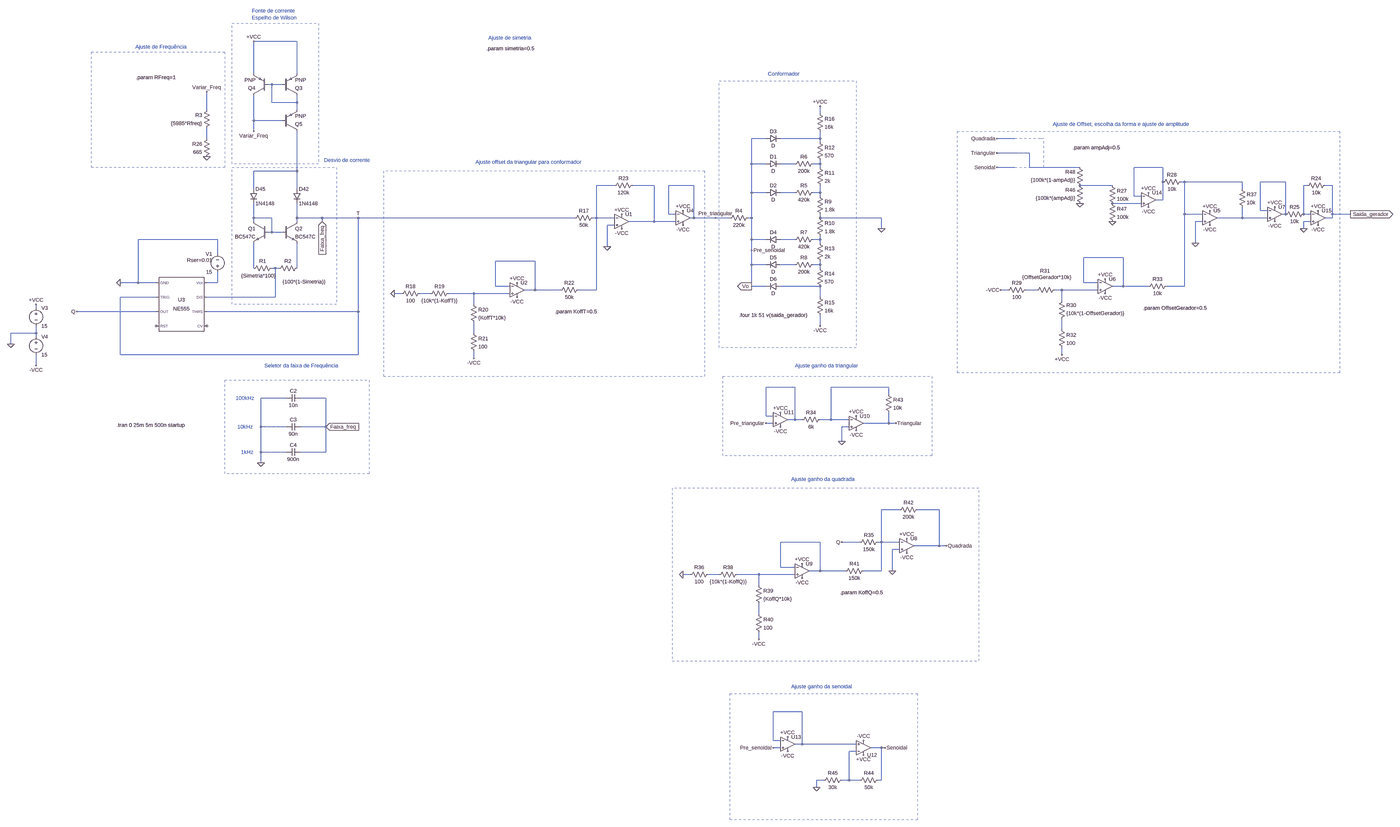
[diagram p0: schematic gerador_funcoes.asc, whole sheet]
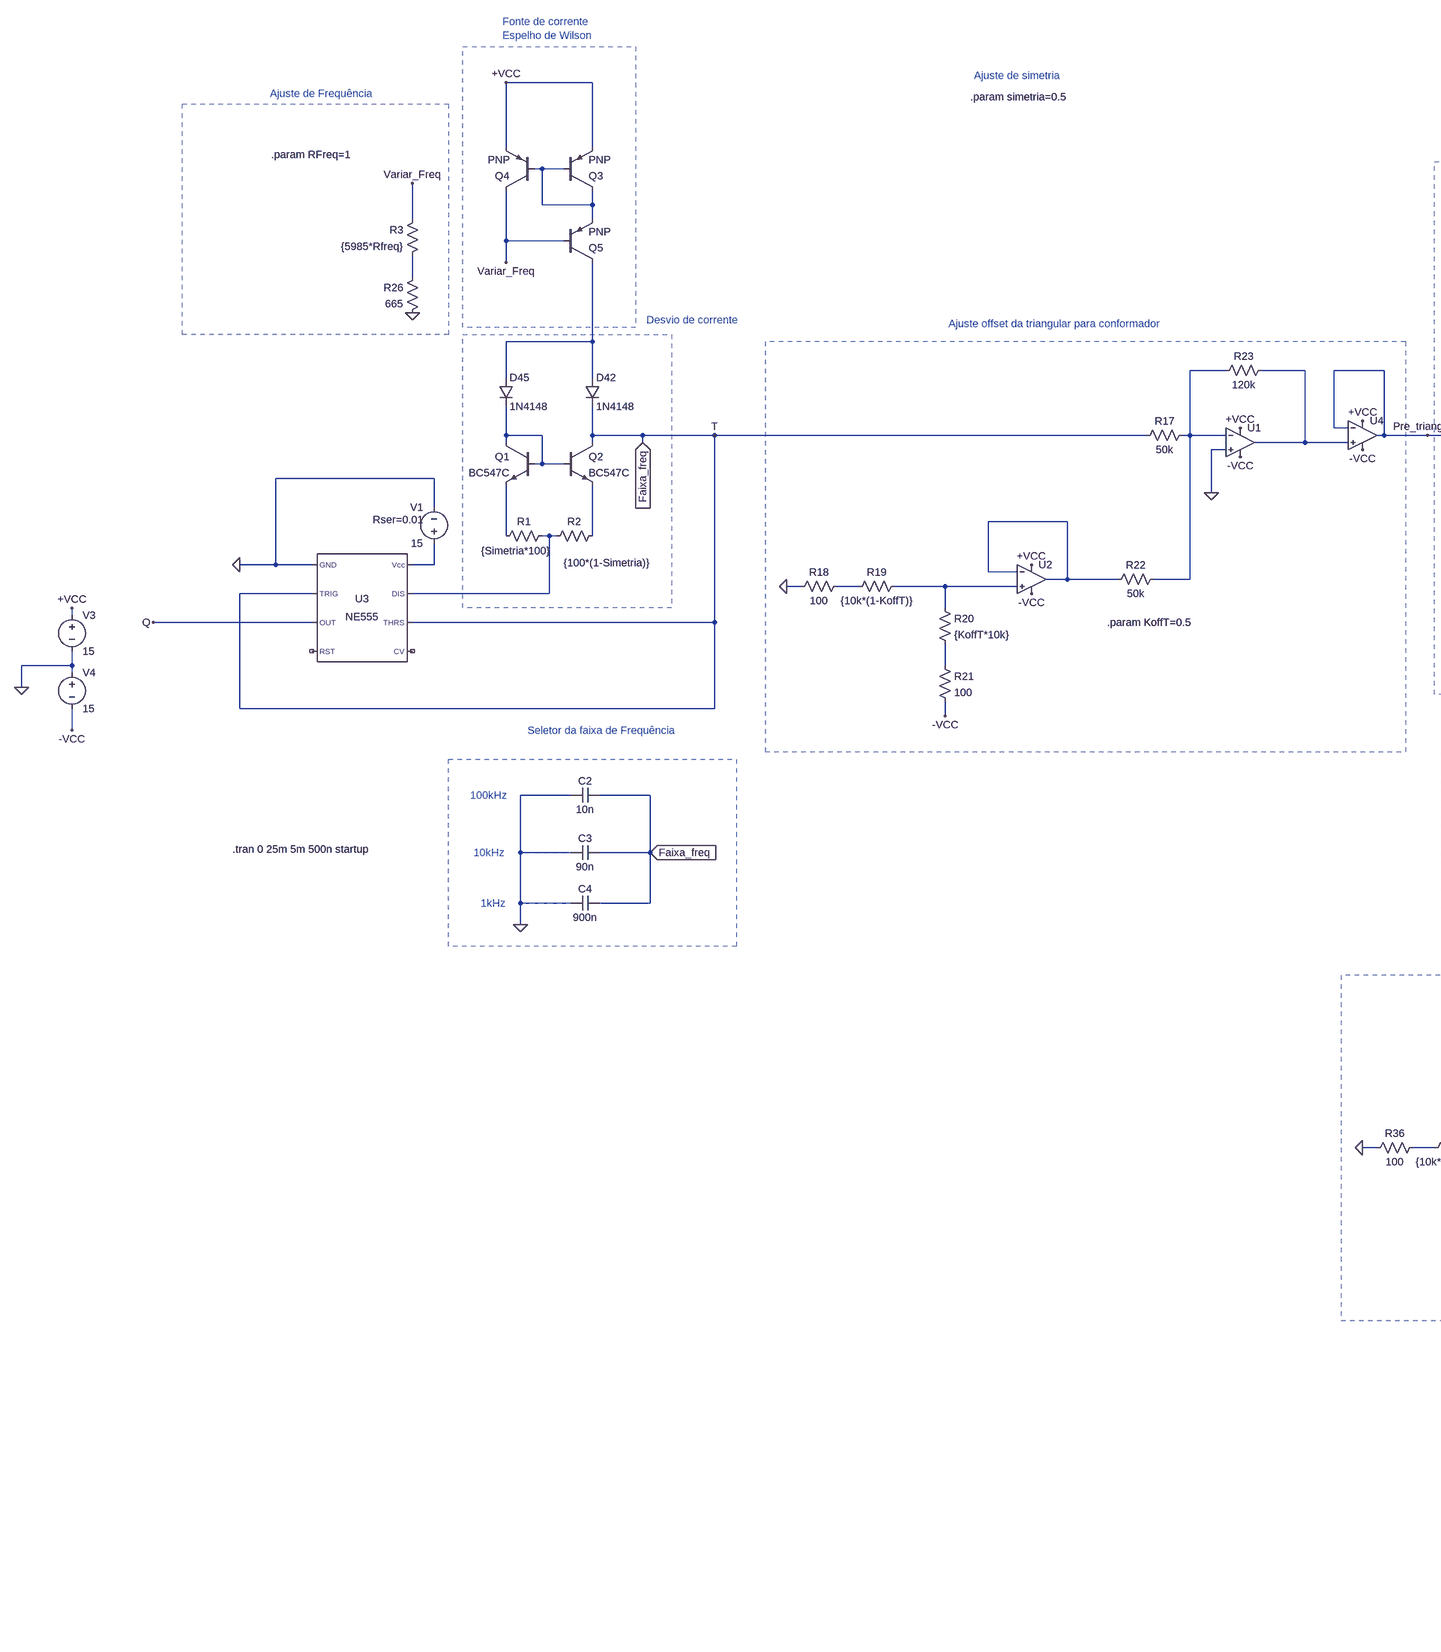
[diagram p1: schematic gerador_funcoes.asc, part, row 1 of 1, column 1 of 2]
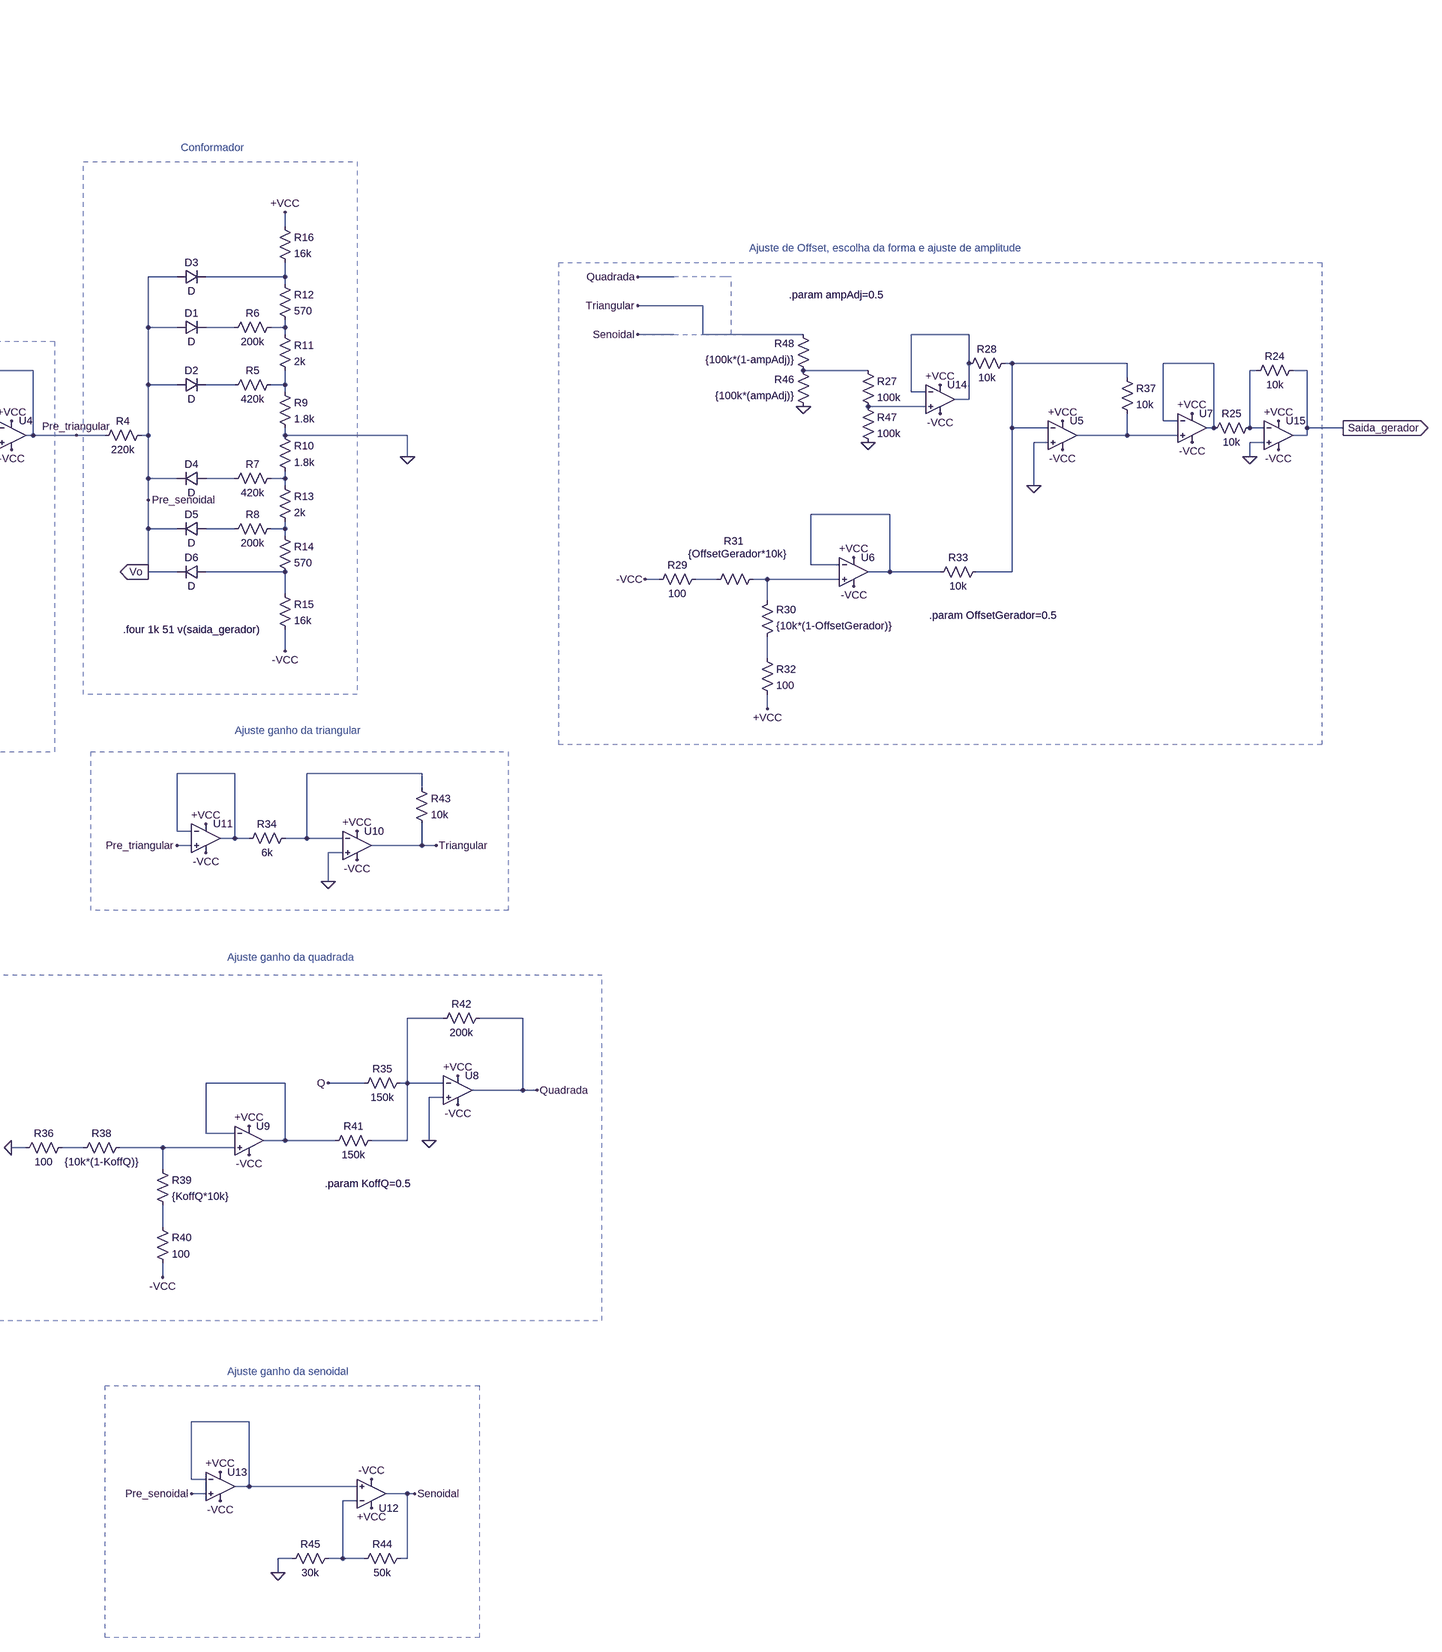
[diagram p2: schematic gerador_funcoes.asc, part, row 1 of 1, column 2 of 2]
gerador_funcoes.asc, the LTspice schematic file:
Version 4
SHEET 1 6488 2340
WIRE 1136 -1136 944 -1136
WIRE 944 -992 944 -1136
WIRE 1136 -992 1136 -1136
WIRE 1024 -944 1008 -944
WIRE 1072 -944 1024 -944
WIRE 1024 -864 1024 -944
WIRE 1136 -864 1136 -896
WIRE 1136 -864 1024 -864
WIRE 736 -832 736 -912
WIRE 1136 -832 1136 -864
WIRE 3456 -816 3456 -848
WIRE 944 -784 944 -896
WIRE 1072 -784 944 -784
WIRE 944 -736 944 -784
WIRE 736 -704 736 -752
WIRE 3216 -704 3152 -704
WIRE 3456 -704 3456 -736
WIRE 3456 -704 3280 -704
WIRE 4320 -704 4240 -704
WIRE 3456 -688 3456 -704
WIRE 4384 -640 4240 -640
WIRE 3152 -592 3152 -704
WIRE 3216 -592 3152 -592
WIRE 3344 -592 3280 -592
WIRE 3456 -592 3456 -608
WIRE 3456 -592 3424 -592
WIRE 3456 -576 3456 -592
WIRE 4320 -576 4240 -576
WIRE 4384 -576 4384 -640
WIRE 4608 -576 4384 -576
WIRE 4976 -576 4848 -576
WIRE 1136 -560 1136 -736
WIRE 1136 -560 944 -560
WIRE 4976 -512 4976 -576
WIRE 5072 -512 5056 -512
WIRE 5328 -512 5072 -512
WIRE 5520 -512 5408 -512
WIRE 2544 -496 2464 -496
WIRE 2720 -496 2624 -496
WIRE 2896 -496 2784 -496
WIRE 4752 -496 4608 -496
WIRE 5616 -496 5600 -496
WIRE 5728 -496 5696 -496
WIRE 944 -480 944 -560
WIRE 1136 -480 1136 -560
WIRE 5328 -480 5328 -512
WIRE 3152 -464 3152 -592
WIRE 3216 -464 3152 -464
WIRE 3344 -464 3280 -464
WIRE 3456 -464 3456 -496
WIRE 3456 -464 3424 -464
WIRE 3456 -448 3456 -464
WIRE 4848 -448 4848 -576
WIRE 4880 -448 4848 -448
WIRE 4976 -432 4976 -512
WIRE 4976 -432 4944 -432
WIRE 4880 -416 4752 -416
WIRE 5408 -384 5408 -512
WIRE 5440 -384 5408 -384
WIRE 2784 -368 2784 -496
WIRE 2816 -368 2784 -368
WIRE 5072 -368 5072 -512
WIRE 5152 -368 5072 -368
WIRE 5520 -368 5520 -512
WIRE 5520 -368 5504 -368
WIRE 5600 -368 5600 -496
WIRE 5632 -368 5600 -368
WIRE 5728 -368 5728 -496
WIRE 5808 -368 5728 -368
WIRE 944 -352 944 -416
WIRE 1024 -352 944 -352
WIRE 1136 -352 1136 -416
WIRE 1248 -352 1136 -352
WIRE 1408 -352 1248 -352
WIRE 2368 -352 1408 -352
WIRE 2464 -352 2464 -496
WIRE 2464 -352 2448 -352
WIRE 2544 -352 2464 -352
WIRE 2896 -352 2896 -496
WIRE 2896 -352 2880 -352
WIRE 2992 -352 2896 -352
WIRE 3056 -352 2992 -352
WIRE 3152 -352 3152 -464
WIRE 3152 -352 3136 -352
WIRE 3456 -352 3456 -368
WIRE 3728 -352 3456 -352
WIRE 5328 -352 5328 -400
WIRE 5328 -352 5216 -352
WIRE 5440 -352 5328 -352
WIRE 5728 -352 5728 -368
WIRE 5728 -352 5696 -352
WIRE 944 -336 944 -352
WIRE 1136 -336 1136 -352
WIRE 1248 -336 1248 -352
WIRE 2720 -336 2720 -496
WIRE 2720 -336 2608 -336
WIRE 2816 -336 2720 -336
WIRE 5152 -336 5120 -336
WIRE 5632 -336 5600 -336
WIRE 2544 -320 2512 -320
WIRE 3728 -304 3728 -352
WIRE 5600 -304 5600 -336
WIRE 1024 -288 1024 -352
WIRE 1024 -288 1008 -288
WIRE 1072 -288 1024 -288
WIRE 784 -256 432 -256
WIRE 3152 -256 3152 -352
WIRE 3216 -256 3152 -256
WIRE 3344 -256 3280 -256
WIRE 3456 -256 3456 -272
WIRE 3456 -256 3424 -256
WIRE 3456 -240 3456 -256
WIRE 5120 -240 5120 -336
WIRE 2512 -224 2512 -320
WIRE 3152 -208 3152 -256
WIRE 784 -192 784 -256
WIRE 4800 -176 4624 -176
WIRE 2192 -160 2016 -160
WIRE 3152 -144 3152 -208
WIRE 3216 -144 3152 -144
WIRE 3344 -144 3280 -144
WIRE 3456 -144 3456 -160
WIRE 3456 -144 3424 -144
WIRE 944 -128 944 -240
WIRE 1040 -128 1024 -128
WIRE 1056 -128 1040 -128
WIRE 1136 -128 1136 -240
WIRE 3456 -128 3456 -144
WIRE 432 -64 432 -256
WIRE 432 -64 352 -64
WIRE 512 -64 432 -64
WIRE 784 -64 784 -112
WIRE 784 -64 736 -64
WIRE 4624 -64 4624 -176
WIRE 4688 -64 4624 -64
WIRE 2016 -48 2016 -160
WIRE 2080 -48 2016 -48
WIRE 3152 -48 3152 -144
WIRE 3216 -48 3152 -48
WIRE 3456 -48 3280 -48
WIRE 4800 -48 4800 -176
WIRE 4800 -48 4752 -48
WIRE 4912 -48 4800 -48
WIRE 5072 -48 5072 -368
WIRE 5072 -48 4992 -48
WIRE 2192 -32 2192 -160
WIRE 2192 -32 2144 -32
WIRE 2304 -32 2192 -32
WIRE 2464 -32 2464 -352
WIRE 2464 -32 2384 -32
WIRE 4288 -32 4256 -32
WIRE 4416 -32 4368 -32
WIRE 4528 -32 4496 -32
WIRE 4688 -32 4528 -32
WIRE 1600 -16 1568 -16
WIRE 1728 -16 1680 -16
WIRE 1920 -16 1808 -16
WIRE 2080 -16 1920 -16
WIRE 512 0 352 0
WIRE 1040 0 1040 -128
WIRE 1040 0 736 0
WIRE 3456 0 3456 -48
WIRE 4528 16 4528 -32
WIRE 1920 32 1920 -16
WIRE -176 48 -176 32
WIRE 512 64 160 64
WIRE 1408 64 1408 -352
WIRE 1408 64 736 64
WIRE 3456 128 3456 80
WIRE 4528 144 4528 96
WIRE -176 160 -176 128
WIRE -176 160 -288 160
WIRE 1920 160 1920 112
WIRE -176 176 -176 160
WIRE -288 208 -288 160
WIRE 352 256 352 0
WIRE 1408 256 1408 64
WIRE 1408 256 352 256
WIRE 4528 256 4528 224
WIRE 1920 272 1920 240
WIRE -176 304 -176 256
WIRE 3344 400 3216 400
WIRE 3760 400 3504 400
WIRE 3760 432 3760 400
WIRE 1088 448 976 448
WIRE 1264 448 1152 448
WIRE 3216 528 3216 400
WIRE 3248 528 3216 528
WIRE 3344 544 3344 400
WIRE 3344 544 3312 544
WIRE 3376 544 3344 544
WIRE 3504 544 3504 400
WIRE 3504 544 3456 544
WIRE 3584 544 3504 544
WIRE 3248 560 3216 560
WIRE 3760 560 3760 512
WIRE 3760 560 3648 560
WIRE 3792 560 3760 560
WIRE 976 576 976 448
WIRE 1088 576 976 576
WIRE 1264 576 1264 448
WIRE 1264 576 1152 576
WIRE 3584 576 3552 576
WIRE 3552 640 3552 576
WIRE 976 688 976 576
WIRE 1088 688 976 688
WIRE 1264 688 1264 576
WIRE 1264 688 1152 688
WIRE 976 736 976 688
WIRE 3808 944 3728 944
WIRE 3984 944 3888 944
WIRE 3456 1088 3280 1088
WIRE 3632 1088 3552 1088
WIRE 3728 1088 3728 944
WIRE 3728 1088 3712 1088
WIRE 3808 1088 3728 1088
WIRE 3984 1104 3984 944
WIRE 3984 1104 3872 1104
WIRE 4016 1104 3984 1104
WIRE 3808 1120 3776 1120
WIRE 3280 1200 3280 1088
WIRE 3344 1200 3280 1200
WIRE 3456 1216 3456 1088
WIRE 3456 1216 3408 1216
WIRE 3568 1216 3456 1216
WIRE 3728 1216 3728 1088
WIRE 3728 1216 3648 1216
WIRE 3776 1216 3776 1120
WIRE 2880 1232 2848 1232
WIRE 3008 1232 2960 1232
WIRE 3184 1232 3088 1232
WIRE 3344 1232 3184 1232
WIRE 3184 1280 3184 1232
WIRE 3184 1408 3184 1360
WIRE 3184 1520 3184 1488
WIRE 3376 1856 3248 1856
WIRE 3248 1984 3248 1856
WIRE 3280 1984 3248 1984
WIRE 3376 2000 3376 1856
WIRE 3376 2000 3344 2000
WIRE 3616 2000 3376 2000
WIRE 3280 2016 3248 2016
WIRE 3728 2016 3680 2016
WIRE 3744 2016 3728 2016
WIRE 3616 2032 3584 2032
WIRE 3472 2160 3440 2160
WIRE 3584 2160 3584 2032
WIRE 3584 2160 3552 2160
WIRE 3632 2160 3584 2160
WIRE 3728 2160 3728 2016
WIRE 3728 2160 3712 2160
WIRE 3440 2192 3440 2160
FLAG 352 -64 0
FLAG 160 64 Q
FLAG 1408 -352 T
FLAG 3728 -304 0
FLAG 3152 -48 Vo
IOPIN 3152 -48 Out
FLAG 3456 128 -VCC
FLAG -176 304 -VCC
FLAG 3456 -848 +VCC
FLAG -176 32 +VCC
FLAG -288 208 0
FLAG 2576 -368 +VCC
FLAG 2576 -304 -VCC
FLAG 1920 272 -VCC
FLAG 2112 -64 +VCC
FLAG 2112 0 -VCC
FLAG 2512 -224 0
FLAG 1568 -16 0
FLAG 2848 -384 +VCC
FLAG 2848 -320 -VCC
FLAG 1264 576 Faixa_freq
IOPIN 1264 576 In
FLAG 1248 -336 Faixa_freq
IOPIN 1248 -336 In
FLAG 976 736 0
FLAG 736 -624 0
FLAG 736 -912 Variar_Freq
FLAG 5184 -384 +VCC
FLAG 5184 -320 -VCC
FLAG 4528 256 +VCC
FLAG 4720 -80 +VCC
FLAG 4720 -16 -VCC
FLAG 5120 -240 0
FLAG 5472 -400 +VCC
FLAG 5472 -336 -VCC
FLAG 4256 -32 -VCC
FLAG 4240 -704 Quadrada
FLAG 3152 -208 Pre_senoidal
FLAG 5808 -368 Saida_gerador
IOPIN 5808 -368 Out
FLAG 2992 -352 Pre_triangular
FLAG 3216 560 Pre_triangular
FLAG 3840 1072 +VCC
FLAG 3840 1136 -VCC
FLAG 3552 1088 Q
FLAG 3184 1520 -VCC
FLAG 3376 1184 +VCC
FLAG 3376 1248 -VCC
FLAG 3776 1216 0
FLAG 2848 1232 0
FLAG 4016 1104 Quadrada
FLAG 3616 528 +VCC
FLAG 3616 592 -VCC
FLAG 3552 640 0
FLAG 3280 512 +VCC
FLAG 3280 576 -VCC
FLAG 3648 2048 +VCC
FLAG 3648 1984 -VCC
FLAG 3312 1968 +VCC
FLAG 3312 2032 -VCC
FLAG 3248 2016 Pre_senoidal
FLAG 3440 2192 0
FLAG 4608 -416 0
FLAG 4912 -464 +VCC
FLAG 4912 -400 -VCC
FLAG 944 -736 Variar_Freq
FLAG 944 -1136 +VCC
FLAG 4240 -640 Triangular
FLAG 3792 560 Triangular
FLAG 3744 2016 Senoidal
FLAG 4240 -576 Senoidal
FLAG 5664 -384 +VCC
FLAG 5664 -320 -VCC
FLAG 5600 -304 0
FLAG 4752 -336 0
SYMBOL Misc\\NE555 624 32 R0
SYMATTR InstName U3
SYMBOL diode 928 -480 R0
SYMATTR InstName D45
SYMATTR Value 1N4148
SYMBOL diode 1120 -480 R0
SYMATTR InstName D42
SYMATTR Value 1N4148
SYMBOL npn 1008 -336 M0
SYMATTR InstName Q1
SYMATTR Value BC547C
SYMBOL npn 1072 -336 R0
SYMATTR InstName Q2
SYMATTR Value BC547C
SYMBOL res 1040 -144 R90
WINDOW 0 0 56 VBottom 2
WINDOW 3 33 74 VTop 2
SYMATTR InstName R1
SYMATTR Value {Simetria*100}
SYMBOL res 1152 -144 R90
WINDOW 0 0 56 VBottom 2
WINDOW 3 60 -16 VTop 2
SYMATTR InstName R2
SYMATTR Value {100*(1-Simetria)}
SYMBOL voltage 784 -96 R180
WINDOW 0 24 96 Left 2
WINDOW 3 24 16 Left 2
WINDOW 123 0 0 Left 0
WINDOW 39 24 68 Left 2
SYMATTR InstName V1
SYMATTR Value 15
SYMATTR SpiceLine Rser=0.01
SYMBOL res 3152 -368 R90
WINDOW 0 0 56 VBottom 2
WINDOW 3 32 56 VTop 2
SYMATTR InstName R4
SYMATTR Value 220k
SYMBOL res 3440 -480 R90
WINDOW 0 0 56 VBottom 2
WINDOW 3 32 56 VTop 2
SYMATTR InstName R5
SYMATTR Value 420k
SYMBOL res 3440 -608 R90
WINDOW 0 0 56 VBottom 2
WINDOW 3 32 56 VTop 2
SYMATTR InstName R6
SYMATTR Value 200k
SYMBOL res 3440 -272 R90
WINDOW 0 0 56 VBottom 2
WINDOW 3 32 56 VTop 2
SYMATTR InstName R7
SYMATTR Value 420k
SYMBOL res 3440 -160 R90
WINDOW 0 0 56 VBottom 2
WINDOW 3 32 56 VTop 2
SYMATTR InstName R8
SYMATTR Value 200k
SYMBOL res 3440 -464 R0
SYMATTR InstName R9
SYMATTR Value 1.8k
SYMBOL res 3440 -368 R0
SYMATTR InstName R10
SYMATTR Value 1.8k
SYMBOL res 3440 -592 R0
SYMATTR InstName R11
SYMATTR Value 2k
SYMBOL res 3440 -704 R0
SYMATTR InstName R12
SYMATTR Value 570
SYMBOL res 3440 -256 R0
SYMATTR InstName R13
SYMATTR Value 2k
SYMBOL res 3440 -144 R0
SYMATTR InstName R14
SYMATTR Value 570
SYMBOL res 3440 -16 R0
SYMATTR InstName R15
SYMATTR Value 16k
SYMBOL res 3440 -832 R0
SYMATTR InstName R16
SYMATTR Value 16k
SYMBOL voltage -176 32 R0
WINDOW 123 0 0 Left 0
WINDOW 39 0 0 Left 0
SYMATTR InstName V3
SYMATTR Value 15
SYMBOL voltage -176 160 R0
WINDOW 123 0 0 Left 0
WINDOW 39 0 0 Left 0
SYMATTR InstName V4
SYMATTR Value 15
SYMBOL diode 3216 -576 R270
WINDOW 0 32 32 VTop 2
WINDOW 3 0 32 VBottom 2
SYMATTR InstName D1
SYMBOL diode 3216 -448 R270
WINDOW 0 32 32 VTop 2
WINDOW 3 0 32 VBottom 2
SYMATTR InstName D2
SYMBOL diode 3216 -688 R270
WINDOW 0 32 32 VTop 2
WINDOW 3 0 32 VBottom 2
SYMATTR InstName D3
SYMBOL diode 3280 -272 R90
WINDOW 0 0 32 VBottom 2
WINDOW 3 32 32 VTop 2
SYMATTR InstName D4
SYMBOL diode 3280 -160 R90
WINDOW 0 0 32 VBottom 2
WINDOW 3 32 32 VTop 2
SYMATTR InstName D5
SYMBOL diode 3280 -64 R90
WINDOW 0 0 32 VBottom 2
WINDOW 3 32 32 VTop 2
SYMATTR InstName D6
SYMBOL Opamps\\UniversalOpamp2 2576 -336 R0
SYMATTR InstName U1
SYMBOL res 2464 -368 R90
WINDOW 0 0 56 VBottom 2
WINDOW 3 32 56 VTop 2
SYMATTR InstName R17
SYMATTR Value 50k
SYMBOL res 1696 -32 R90
WINDOW 0 0 56 VBottom 2
WINDOW 3 32 56 VTop 2
SYMATTR InstName R18
SYMATTR Value 100
SYMBOL res 1824 -32 R90
WINDOW 0 0 56 VBottom 2
WINDOW 3 32 56 VTop 2
SYMATTR InstName R19
SYMATTR Value {10k*(1-KoffT)}
SYMBOL res 1904 16 R0
SYMATTR InstName R20
SYMATTR Value {KoffT*10k}
SYMBOL res 1904 144 R0
SYMATTR InstName R21
SYMATTR Value 100
SYMBOL Opamps\\UniversalOpamp2 2112 -32 R0
SYMATTR InstName U2
SYMBOL res 2400 -48 R90
WINDOW 0 0 56 VBottom 2
WINDOW 3 32 56 VTop 2
SYMATTR InstName R22
SYMATTR Value 50k
SYMBOL res 2640 -512 R90
WINDOW 0 0 56 VBottom 2
WINDOW 3 32 56 VTop 2
SYMATTR InstName R23
SYMATTR Value 120k
SYMBOL Opamps\\UniversalOpamp2 2848 -352 R0
SYMATTR InstName U4
SYMBOL cap 1152 432 R90
WINDOW 0 0 32 VBottom 2
WINDOW 3 32 32 VTop 2
SYMATTR InstName C2
SYMATTR Value 10n
SYMBOL cap 1152 560 R90
WINDOW 0 0 32 VBottom 2
WINDOW 3 32 32 VTop 2
SYMATTR InstName C3
SYMATTR Value 90n
SYMBOL cap 1152 672 R90
WINDOW 0 0 32 VBottom 2
WINDOW 3 32 32 VTop 2
SYMATTR InstName C4
SYMATTR Value 900n
SYMBOL res 752 -720 M0
SYMATTR InstName R26
SYMATTR Value 665
SYMBOL Opamps\\UniversalOpamp2 5184 -352 R0
SYMATTR InstName U5
SYMBOL res 5072 -528 R90
WINDOW 0 0 56 VBottom 2
WINDOW 3 32 56 VTop 2
SYMATTR InstName R28
SYMATTR Value 10k
SYMBOL res 4384 -48 R90
WINDOW 0 0 56 VBottom 2
WINDOW 3 32 56 VTop 2
SYMATTR InstName R29
SYMATTR Value 100
SYMBOL res 4512 112 M180
WINDOW 0 36 76 Left 2
WINDOW 3 36 40 Left 2
SYMATTR InstName R30
SYMATTR Value {10k*(1-OffsetGerador)}
SYMBOL res 4512 -48 R90
WINDOW 0 -53 59 VBottom 2
WINDOW 3 -56 51 VTop 2
SYMATTR InstName R31
SYMATTR Value {OffsetGerador*10k}
SYMBOL res 4512 128 R0
SYMATTR InstName R32
SYMATTR Value 100
SYMBOL Opamps\\UniversalOpamp2 4720 -48 R0
SYMATTR InstName U6
SYMBOL res 5008 -64 R90
WINDOW 0 0 56 VBottom 2
WINDOW 3 32 56 VTop 2
SYMATTR InstName R33
SYMATTR Value 10k
SYMBOL Opamps\\UniversalOpamp2 5472 -368 R0
SYMATTR InstName U7
SYMBOL res 5312 -496 R0
SYMATTR InstName R37
SYMATTR Value 10k
SYMBOL Opamps\\UniversalOpamp2 3840 1104 R0
SYMATTR InstName U8
SYMBOL res 3728 1072 R90
WINDOW 0 0 56 VBottom 2
WINDOW 3 32 56 VTop 2
SYMATTR InstName R35
SYMATTR Value 150k
SYMBOL res 2976 1216 R90
WINDOW 0 0 56 VBottom 2
WINDOW 3 32 56 VTop 2
SYMATTR InstName R36
SYMATTR Value 100
SYMBOL res 3104 1216 R90
WINDOW 0 0 56 VBottom 2
WINDOW 3 32 56 VTop 2
SYMATTR InstName R38
SYMATTR Value {10k*(1-KoffQ)}
SYMBOL res 3168 1264 R0
SYMATTR InstName R39
SYMATTR Value {KoffQ*10k}
SYMBOL res 3168 1392 R0
SYMATTR InstName R40
SYMATTR Value 100
SYMBOL Opamps\\UniversalOpamp2 3376 1216 R0
SYMATTR InstName U9
SYMBOL res 3664 1200 R90
WINDOW 0 0 56 VBottom 2
WINDOW 3 32 56 VTop 2
SYMATTR InstName R41
SYMATTR Value 150k
SYMBOL res 3904 928 R90
WINDOW 0 0 56 VBottom 2
WINDOW 3 32 56 VTop 2
SYMATTR InstName R42
SYMATTR Value 200k
SYMBOL Opamps\\UniversalOpamp2 3616 560 R0
SYMATTR InstName U10
SYMBOL res 3472 528 R90
WINDOW 0 0 56 VBottom 2
WINDOW 3 32 56 VTop 2
SYMATTR InstName R34
SYMATTR Value 6k
SYMBOL res 3744 416 R0
SYMATTR InstName R43
SYMATTR Value 10k
SYMBOL Opamps\\UniversalOpamp2 3280 544 R0
SYMATTR InstName U11
SYMBOL Opamps\\UniversalOpamp2 3648 2016 M180
SYMATTR InstName U12
SYMBOL Opamps\\UniversalOpamp2 3312 2000 R0
SYMATTR InstName U13
SYMBOL res 3728 2144 R90
WINDOW 0 0 56 VBottom 2
WINDOW 3 32 56 VTop 2
SYMATTR InstName R44
SYMATTR Value 50k
SYMBOL res 3568 2144 R90
WINDOW 0 0 56 VBottom 2
WINDOW 3 32 56 VTop 2
SYMATTR InstName R45
SYMATTR Value 30k
SYMBOL res 4624 -480 R180
WINDOW 0 36 76 Left 2
WINDOW 3 36 40 Left 2
SYMATTR InstName R48
SYMATTR Value {100k*(1-ampAdj)}
SYMBOL res 4624 -400 R180
WINDOW 0 36 76 Left 2
WINDOW 3 36 40 Left 2
SYMATTR InstName R46
SYMATTR Value {100k*(ampAdj)}
SYMBOL Opamps\\UniversalOpamp2 4912 -432 R0
SYMATTR InstName U14
SYMBOL pnp 1072 -896 M180
SYMATTR InstName Q3
SYMBOL pnp 1008 -896 R180
SYMATTR InstName Q4
SYMBOL pnp 1072 -736 M180
SYMATTR InstName Q5
SYMBOL res 752 -848 M0
SYMATTR InstName R3
SYMATTR Value {5985*Rfreq}
SYMBOL Opamps\\UniversalOpamp2 5664 -352 R0
SYMATTR InstName U15
SYMBOL res 5712 -512 R90
WINDOW 0 0 56 VBottom 2
WINDOW 3 32 56 VTop 2
SYMATTR InstName R24
SYMATTR Value 10k
SYMBOL res 5616 -384 R90
WINDOW 0 0 56 VBottom 2
WINDOW 3 32 56 VTop 2
SYMATTR InstName R25
SYMATTR Value 10k
SYMBOL res 4736 -512 R0
SYMATTR InstName R27
SYMATTR Value 100k
SYMBOL res 4736 -432 R0
SYMATTR InstName R47
SYMATTR Value 100k
TEXT 336 568 Left 2 !.tran 0 25m 5m 500n startup
TEXT 3096 80 Left 2 !.four 1k 51 v(saida_gerador)
TEXT 2280 64 Left 2 !.param KoffT=0.5
TEXT 888 688 Left 2 ;1kHz
TEXT 872 576 Left 2 ;10kHz
TEXT 864 448 Left 2 ;100kHz
TEXT 992 304 Left 2 ;Seletor da faixa de Frequência
TEXT 600 -976 Right 2 !.param RFreq=1
TEXT 648 -1112 Right 2 ;Ajuste de Frequência
TEXT 4888 48 Left 2 !.param OffsetGerador=0.5
TEXT 4488 -768 Left 2 ;Ajuste de Offset, escolha da forma e ajuste de amplitude
TEXT 1984 -1152 Left 2 ;Ajuste de simetria
TEXT 1976 -1104 Left 2 !.param simetria=0.5
TEXT 3224 -992 Left 2 ;Conformador
TEXT 3544 1312 Left 2 !.param KoffQ=0.5
TEXT 4576 -664 Left 2 !.param ampAdj=0.5
TEXT 3344 304 Left 2 ;Ajuste ganho da triangular
TEXT 3328 808 Left 2 ;Ajuste ganho da quadrada
TEXT 3328 1744 Left 2 ;Ajuste ganho da senoidal
TEXT 1928 -600 Left 2 ;Ajuste offset da triangular para conformador
TEXT 936 -1272 Left 2 ;Fonte de corrente\nEspelho de Wilson
TEXT 1256 -608 Left 2 ;Desvio de corrente
LINE Normal 4384 -640 4320 -640 2
LINE Normal 4384 -576 4384 -640 2
LINE Normal 4432 -704 4320 -704 2
LINE Normal 4448 -704 4432 -704 2
LINE Normal 4448 -576 4448 -704 2
LINE Normal 4240 -576 4480 -576 2
LINE Normal 976 688 1088 688 2
LINE Normal 976 576 1088 576 2
RECTANGLE Normal 5760 336 4064 -736 2
RECTANGLE Normal 3616 224 3008 -960 2
RECTANGLE Normal 1520 352 2944 -560 2
RECTANGLE Normal 1456 784 816 368 2
RECTANGLE Normal 816 -576 224 -1088 2
RECTANGLE Normal 1232 -592 848 -1216 2
RECTANGLE Normal 1312 32 848 -576 2
RECTANGLE Normal 3952 704 3024 352 2
RECTANGLE Normal 2800 1616 4160 848 2
RECTANGLE Normal 3888 2336 3056 1776 2

The netlist it stands for:
* gerador_funcoes.asc
XU3 0 Faixa_freq Q NC_01 NC_02 Faixa_freq N026 N028 NE555  ; pins GND TRIG OUT RST CV THRS DIS Vcc
D45 N007 N017 1N4148
D42 N007 Faixa_freq 1N4148
Q1 N017 N017 N025 0 BC547C
Q2 Faixa_freq N017 N027 0 BC547C
R1 N026 N025 {Simetria*100}
R2 N027 N026 {100*(1-Simetria)}
V1 N028 0 15 Rser=0.01
R4 Pre_senoidal Pre_triangular 220k
R5 N015 N014 420k
R6 N005 N004 200k
R7 N020 N019 420k
R8 N024 N023 200k
R9 N015 0 1.8k
R10 0 N020 1.8k
R11 N005 N015 2k
R12 N003 N005 570
R13 N020 N024 2k
R14 N024 N029 570
R15 N029 -VCC 16k
R16 +VCC N003 16k
V3 +VCC 0 15
V4 0 -VCC 15
D1 Pre_senoidal N004 D
D2 Pre_senoidal N014 D
D3 Pre_senoidal N003 D
D4 N019 Pre_senoidal D
D5 N023 Pre_senoidal D
D6 N029 Pre_senoidal D
XU1 0 N010 +VCC -VCC N011 level.2 Avol=1Meg GBW=10Meg Slew=10Meg ilimit=25m rail=0 Vos=0 phimargin=45 en=0 enk=0 in=0 ink=0 Rin=500Meg  ; pins IN+ IN- V+ V- OUT
R17 N010 Faixa_freq 50k
R18 N032 0 100
R19 N033 N032 {10k*(1-KoffT)}
R20 N033 N035 {KoffT*10k}
R21 N035 -VCC 100
XU2 N033 N022 +VCC -VCC N022 level.2 Avol=1Meg GBW=10Meg Slew=10Meg ilimit=25m rail=0 Vos=0 phimargin=45 en=0 enk=0 in=0 ink=0 Rin=500Meg  ; pins IN+ IN- V+ V- OUT
R22 N010 N022 50k
R23 N011 N010 120k
XU4 N011 Pre_triangular +VCC -VCC Pre_triangular level.2 Avol=1Meg GBW=10Meg Slew=10Meg ilimit=25m rail=0 Vos=0 phimargin=45 en=0 enk=0 in=0 ink=0 Rin=500Meg  ; pins IN+ IN- V+ V- OUT
C2 Faixa_freq 0 10n
C3 Faixa_freq 0 90n
C4 Faixa_freq 0 900n
R26 N002 0 665
XU5 0 N008 +VCC -VCC N018 level.2 Avol=1Meg GBW=10Meg Slew=10Meg ilimit=25m rail=0 Vos=0 phimargin=45 en=0 enk=0 in=0 ink=0 Rin=500Meg  ; pins IN+ IN- V+ V- OUT
R28 N008 N006 10k
R29 N030 -VCC 100
R30 N034 N031 {10k*(1-OffsetGerador)}
R31 N031 N030 {OffsetGerador*10k}
R32 N034 +VCC 100
XU6 N031 N021 +VCC -VCC N021 level.2 Avol=1Meg GBW=10Meg Slew=10Meg ilimit=25m rail=0 Vos=0 phimargin=45 en=0 enk=0 in=0 ink=0 Rin=500Meg  ; pins IN+ IN- V+ V- OUT
R33 N008 N021 10k
XU7 N018 N009 +VCC -VCC N009 level.2 Avol=1Meg GBW=10Meg Slew=10Meg ilimit=25m rail=0 Vos=0 phimargin=45 en=0 enk=0 in=0 ink=0 Rin=500Meg  ; pins IN+ IN- V+ V- OUT
R37 N008 N018 10k
XU8 0 N038 +VCC -VCC Quadrada level.2 Avol=1Meg GBW=10Meg Slew=10Meg ilimit=25m rail=0 Vos=0 phimargin=45 en=0 enk=0 in=0 ink=0 Rin=500Meg  ; pins IN+ IN- V+ V- OUT
R35 N038 Q 150k
R36 N040 0 100
R38 N041 N040 {10k*(1-KoffQ)}
R39 N041 N042 {KoffQ*10k}
R40 N042 -VCC 100
XU9 N041 N039 +VCC -VCC N039 level.2 Avol=1Meg GBW=10Meg Slew=10Meg ilimit=25m rail=0 Vos=0 phimargin=45 en=0 enk=0 in=0 ink=0 Rin=500Meg  ; pins IN+ IN- V+ V- OUT
R41 N038 N039 150k
R42 Quadrada N038 200k
XU10 0 N037 +VCC -VCC Triangular level.2 Avol=1Meg GBW=10Meg Slew=10Meg ilimit=25m rail=0 Vos=0 phimargin=45 en=0 enk=0 in=0 ink=0 Rin=500Meg  ; pins IN+ IN- V+ V- OUT
R34 N037 N036 6k
R43 N037 Triangular 10k
XU11 Pre_triangular N036 +VCC -VCC N036 level.2 Avol=1Meg GBW=10Meg Slew=10Meg ilimit=25m rail=0 Vos=0 phimargin=45 en=0 enk=0 in=0 ink=0 Rin=500Meg  ; pins IN+ IN- V+ V- OUT
XU12 N043 N044 +VCC -VCC Senoidal level.2 Avol=1Meg GBW=10Meg Slew=10Meg ilimit=25m rail=0 Vos=0 phimargin=45 en=0 enk=0 in=0 ink=0 Rin=500Meg  ; pins IN+ IN- V+ V- OUT
XU13 Pre_senoidal N043 +VCC -VCC N043 level.2 Avol=1Meg GBW=10Meg Slew=10Meg ilimit=25m rail=0 Vos=0 phimargin=45 en=0 enk=0 in=0 ink=0 Rin=500Meg  ; pins IN+ IN- V+ V- OUT
R44 Senoidal N044 50k
R45 N044 0 30k
R48 N012 Triangular {100k*(1-ampAdj)}
R46 0 N012 {100k*(ampAdj)}
XU14 N016 N006 +VCC -VCC N006 level.2 Avol=1Meg GBW=10Meg Slew=10Meg ilimit=25m rail=0 Vos=0 phimargin=45 en=0 enk=0 in=0 ink=0 Rin=500Meg  ; pins IN+ IN- V+ V- OUT
Q3 N001 N001 +VCC 0 PNP
Q4 Variar_Freq N001 +VCC 0 PNP
Q5 N007 Variar_Freq N001 0 PNP
R3 Variar_Freq N002 {5985*Rfreq}
XU15 0 N013 +VCC -VCC Saida_gerador level.2 Avol=1Meg GBW=10Meg Slew=10Meg ilimit=25m rail=0 Vos=0 phimargin=45 en=0 enk=0 in=0 ink=0 Rin=500Meg  ; pins IN+ IN- V+ V- OUT
R24 Saida_gerador N013 10k
R25 N013 N009 10k
R27 N012 N016 100k
R47 N016 0 100k
.model D D
.lib standard.dio
.model NPN NPN
.model PNP PNP
.lib standard.bjt
.tran 0 25m 5m 500n startup
.four 1k 51 v(saida_gerador)
.param KoffT=0.5
* 1kHz
* 10kHz
* 100kHz
* Seletor da faixa de Frequência
.param RFreq=1
* Ajuste de Frequência
.param OffsetGerador=0.5
* Ajuste de Offset, escolha da forma e ajuste de amplitude
* Ajuste de simetria
.param simetria=0.5
* Conformador
.param KoffQ=0.5
.param ampAdj=0.5
* Ajuste ganho da triangular
* Ajuste ganho da quadrada
* Ajuste ganho da senoidal
* Ajuste offset da triangular para conformador
* Fonte de corrente
* Espelho de Wilson
* Desvio de corrente
.lib NE555.sub
.lib UniversalOpamps2.sub
.backanno
.end